# EAGLE design HalfMegCoCo (EAGLE 7.7.0)
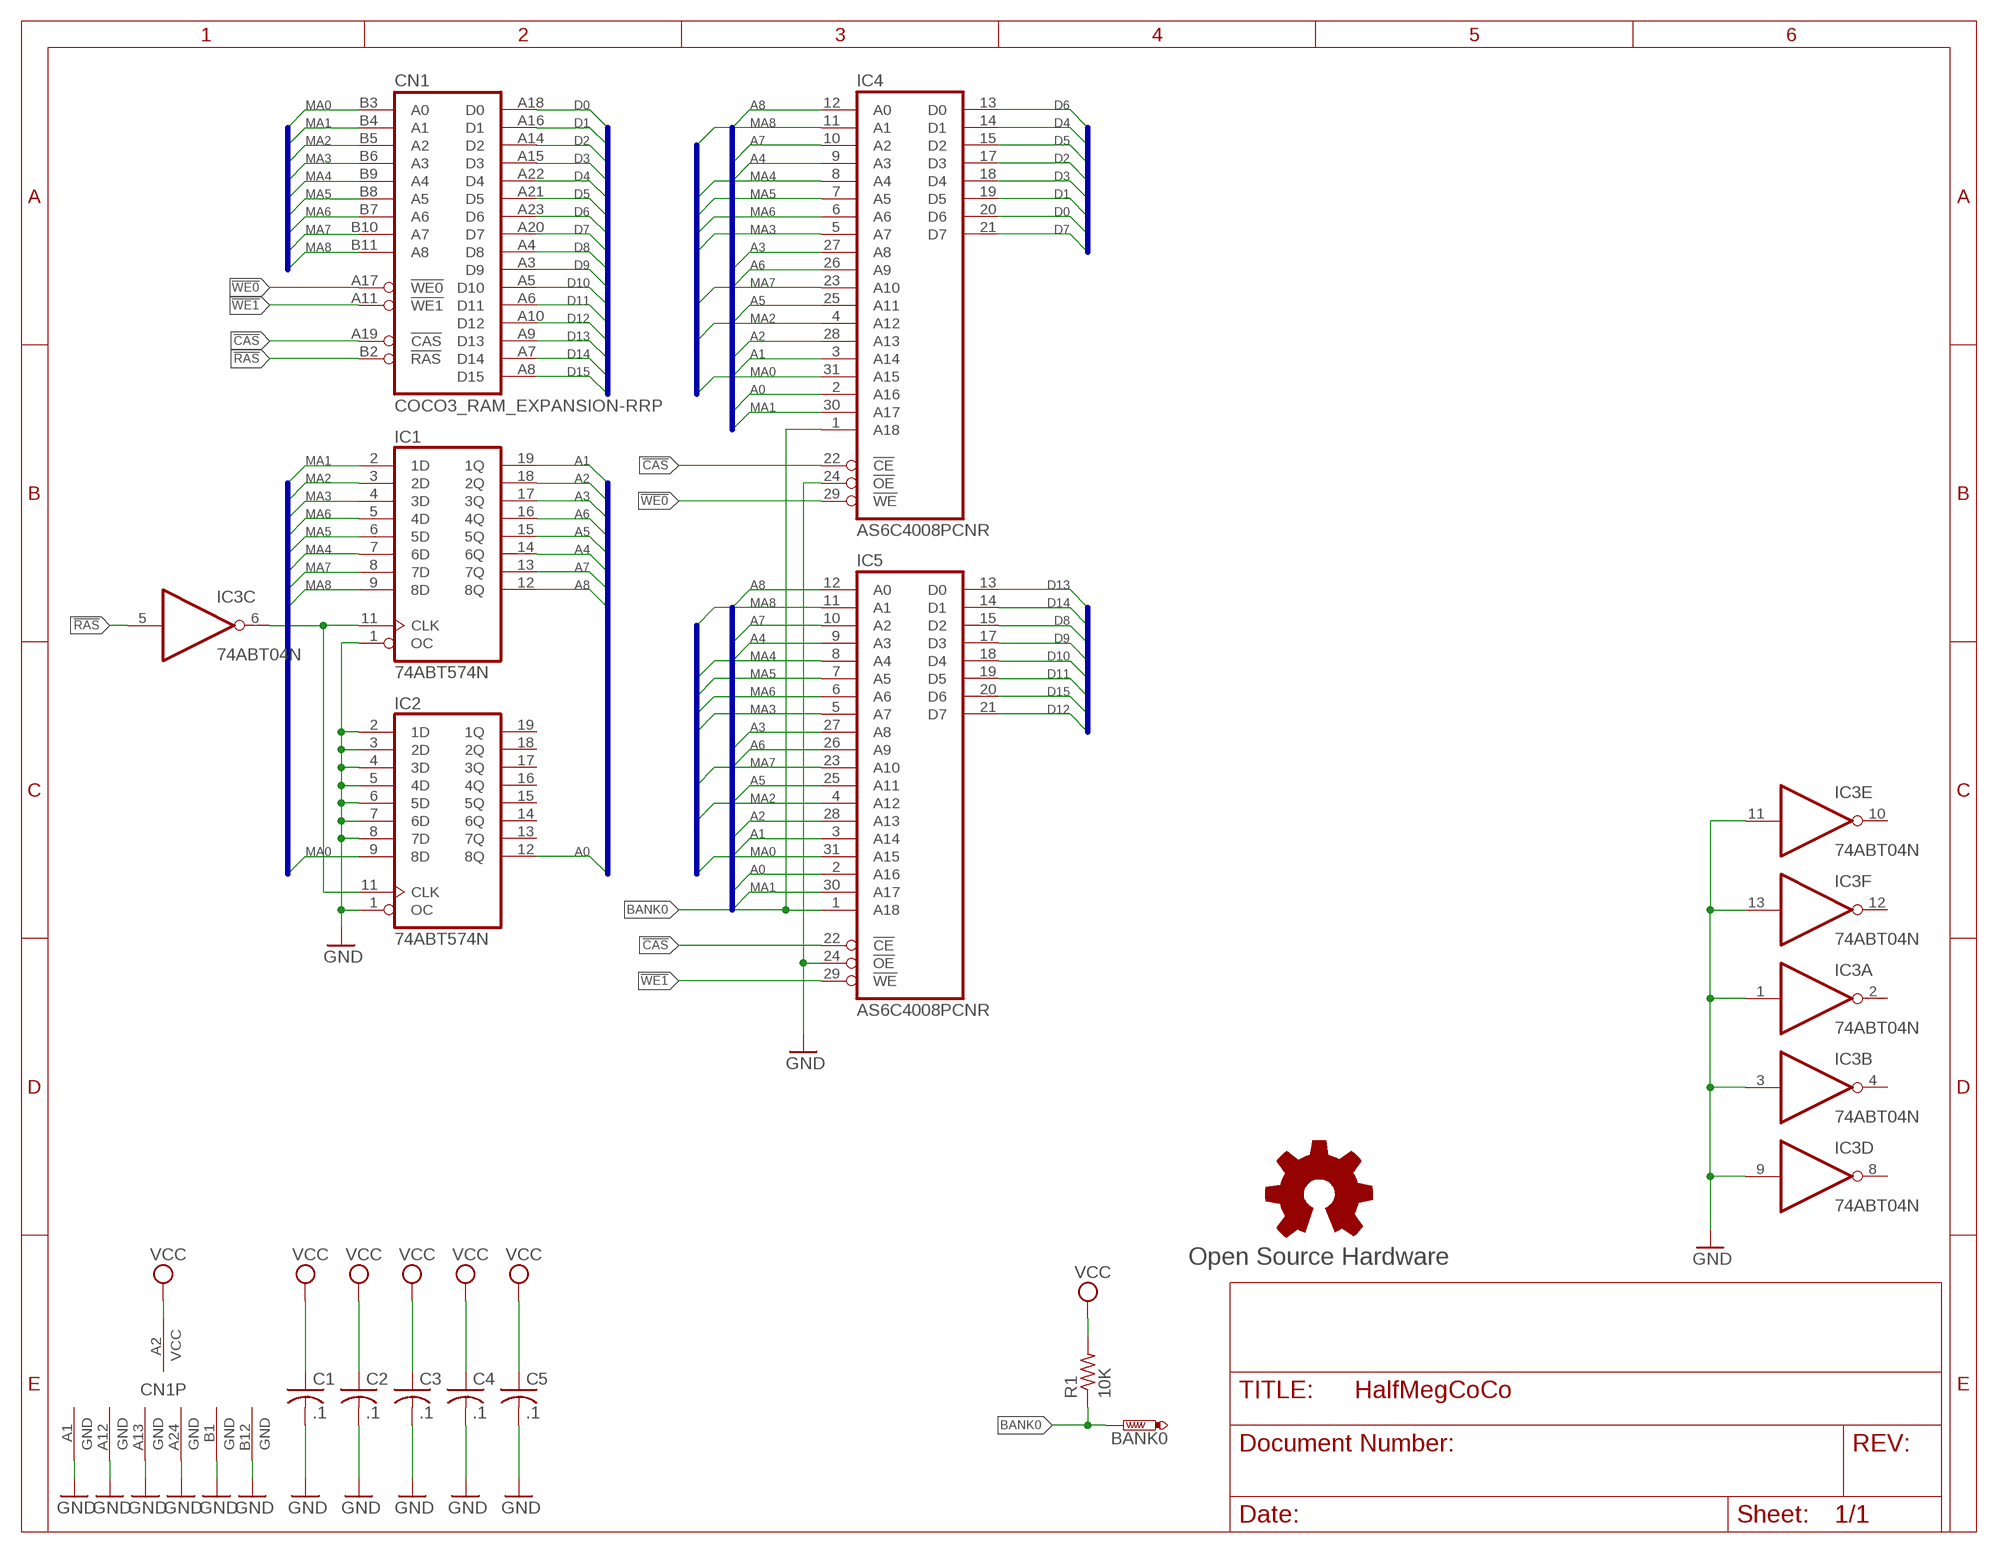
[diagram p0: schematic, sheet 1]

## Parts
BANK0  PTR1PAD1-13  [P1-13]
C1  .1  C-US025-025X050  [C025-025X050]
C2  .1  C-US025-025X050  [C025-025X050]
C3  .1  C-US025-025X050  [C025-025X050]
C4  .1  C-US025-025X050  [C025-025X050]
C5  .1  C-US025-025X050  [C025-025X050]
CN1  COCO3_RAM_EXPANSION-RRP  [RAM_EXPANSION_REV_RP]
GOLD_ORB_SM1  Open Source Hardware  OSHWLOGOLOGO8MM  [OSHW_8MM]
IC1  74ABT574N  74HC574N  [DIL20-RP]
IC2  74ABT574N  74HC574N  [DIL20-RP]
IC3  74ABT04N  74ALS04N  [DIL14-RP]
IC4  AS6C4008PCNR  [DIL32-RP]
IC5  AS6C4008PCNR  [DIL32-RP]
R1  10K  R-US_0204/7  [0204/7]

## Nets
!CAS: CN1.A19(!CAS) IC4.22(!CE) IC5.22(!CE)
!RAS: CN1.B2(!RAS) IC3.5(C:I)
!WE0: CN1.A17(!WE0) IC4.29(!WE)
!WE1: CN1.A11(!WE1) IC5.29(!WE)
A0: IC2.12(8Q) IC4.2(A16) IC5.2(A16)
A1: IC1.19(1Q) IC4.3(A14) IC5.3(A14)
A2: IC1.18(2Q) IC4.28(A13) IC5.28(A13)
A3: IC1.17(3Q) IC4.27(A8) IC5.27(A8)
A4: IC1.14(6Q) IC4.9(A3) IC5.9(A3)
A5: IC1.15(5Q) IC4.25(A11) IC5.25(A11)
A6: IC1.16(4Q) IC4.26(A9) IC5.26(A9)
A7: IC1.13(7Q) IC4.10(A2) IC5.10(A2)
A8: IC1.12(8Q) IC4.12(A0) IC5.12(A0)
BANK0: BANK0.TP IC4.1(A18) IC5.1(A18) R1.1
D0: CN1.A18(D0) IC4.20(D6)
D1: CN1.A16(D1) IC4.19(D5)
D2: CN1.A14(D2) IC4.17(D3)
D3: CN1.A15(D3) IC4.18(D4)
D4: CN1.A22(D4) IC4.14(D1)
D5: CN1.A21(D5) IC4.15(D2)
D6: CN1.A23(D6) IC4.13(D0)
D7: CN1.A20(D7) IC4.21(D7)
D8: CN1.A4(D8) IC5.15(D2)
D9: CN1.A3(D9) IC5.17(D3)
D10: CN1.A5(D10) IC5.18(D4)
D11: CN1.A6(D11) IC5.19(D5)
D12: CN1.A10(D12) IC5.21(D7)
D13: CN1.A9(D13) IC5.13(D0)
D14: CN1.A7(D14) IC5.14(D1)
D15: CN1.A8(D15) IC5.20(D6)
GND: C1.2 C2.2 C3.2 C4.2 C5.2 CN1.A1(GND) CN1.A12(GND) CN1.A13(GND) CN1.A24(GND) CN1.B1(GND) CN1.B12(GND) IC1.1(OC) IC2.1(OC) IC2.2(1D) IC2.3(2D) IC2.4(3D) IC2.5(4D) IC2.6(5D) IC2.7(6D) IC2.8(7D) IC3.1(A:I) IC3.3(B:I) IC3.9(D:I) IC3.11(E:I) IC3.13(F:I) IC4.24(!OE) IC5.24(!OE)
MA0: CN1.B3(A0) IC2.9(8D) IC4.31(A15) IC5.31(A15)
MA1: CN1.B4(A1) IC1.2(1D) IC4.30(A17) IC5.30(A17)
MA2: CN1.B5(A2) IC1.3(2D) IC4.4(A12) IC5.4(A12)
MA3: CN1.B6(A3) IC1.4(3D) IC4.5(A7) IC5.5(A7)
MA4: CN1.B9(A4) IC1.7(6D) IC4.8(A4) IC5.8(A4)
MA5: CN1.B8(A5) IC1.6(5D) IC4.7(A5) IC5.7(A5)
MA6: CN1.B7(A6) IC1.5(4D) IC4.6(A6) IC5.6(A6)
MA7: CN1.B10(A7) IC1.8(7D) IC4.23(A10) IC5.23(A10)
MA8: CN1.B11(A8) IC1.9(8D) IC4.11(A1) IC5.11(A1)
N$6: IC1.11(CLK) IC2.11(CLK) IC3.6(C:O)
VCC: C1.1 C2.1 C3.1 C4.1 C5.1 CN1.A2(VCC) R1.2
Unconnected: IC2.13(7Q) IC2.14(6Q) IC2.15(5Q) IC2.16(4Q) IC2.17(3Q) IC2.18(2Q) IC2.19(1Q) IC3.2(A:O) IC3.4(B:O) IC3.8(D:O) IC3.10(E:O) IC3.12(F:O)

## Buses
D[0..15]
MA[0..8]
A[0..8]

## Power pins joined to a net without a drawn wire
GND: IC1.10(GND) IC2.10(GND) IC3.7(P:GND) IC4.16(GND) IC5.16(GND)
VCC: IC1.20(VCC) IC2.20(VCC) IC3.14(P:VCC) IC4.32(VCC) IC5.32(VCC)

## Library data of the parts
BANK0 = testpad:PTR1: TEST PIN
C1-C5 = rcl:C-US: CAPACITOR, American symbol
CN1 = coco:COCO3_RAM_EXPANSION
GOLD_ORB_SM1 = oshw:OSHWLOGO: The OSHW logo for PCB layout
IC1 IC2 = 74xx-us-jlb:74*574: 8-bit D type FLIP FLOP bus driver
IC3 = 74xx-us-jlb:74*04: Hex INVERTER
IC4 IC5 = memory-alliance:AS6C4008
R1 = resistor:R-US_: RESISTOR, American symbol

## Board
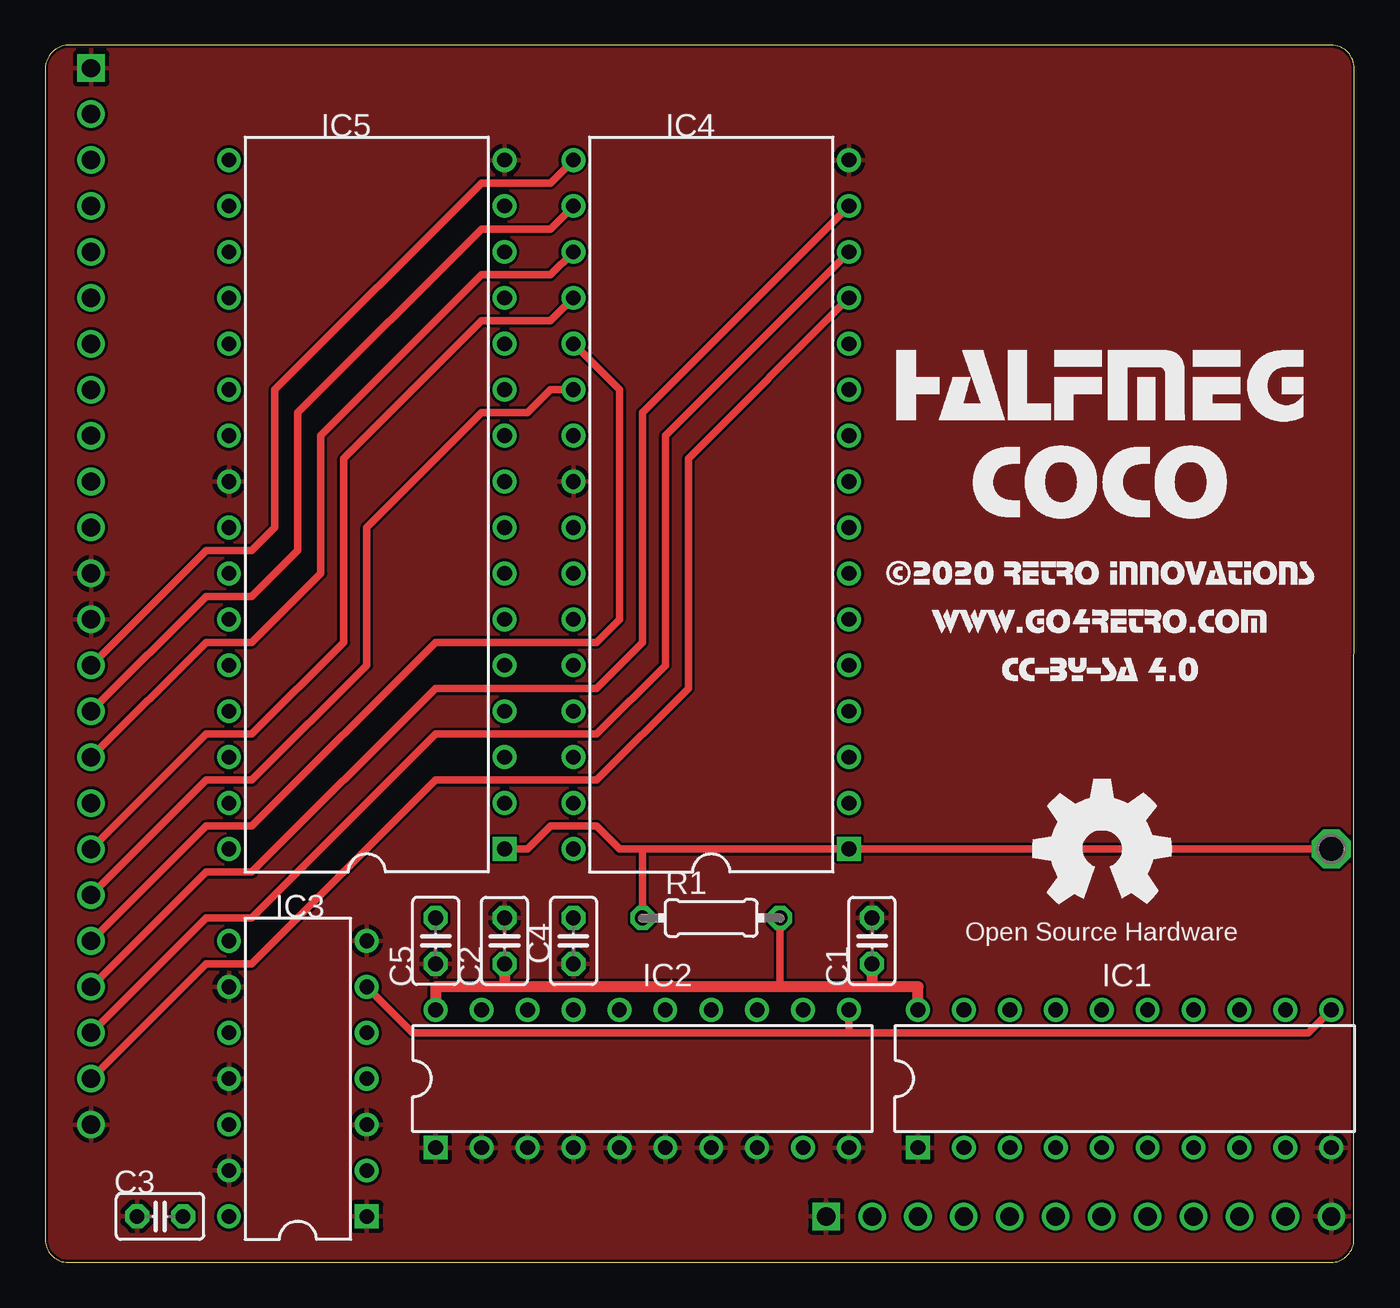
[diagram p1: board, top side]
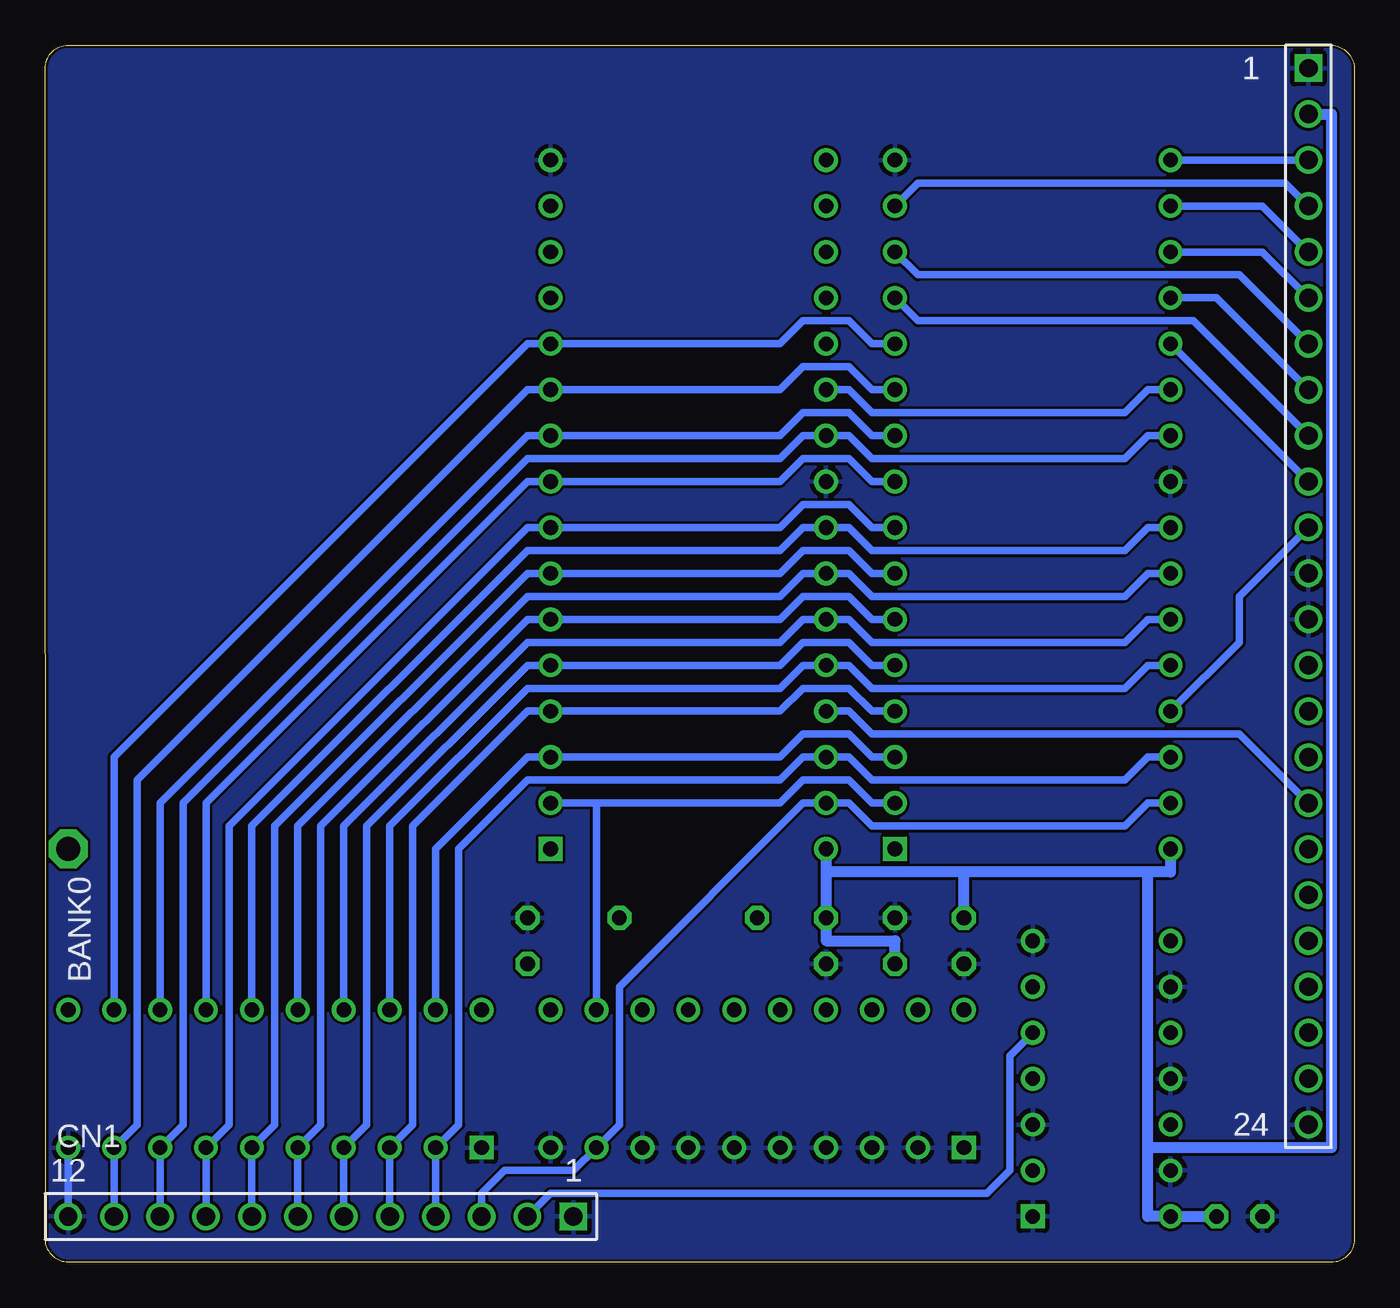
[diagram p2: board, bottom side, seen from below]

Size 72.39 x 67.31 mm. Coordinates in mm from the lower left corner, seen from the top.
Outline: 71.12,67.31 52.06,67.31 1.27,67.31 arc85 0,66.04 0,1.27 arc90 1.27,0 71.1,0 arc90 72.37,1.27 72.39,66.03 arc90 71.12,67.31
Copper layers (1*16): Top 0.035mm / dielectric 1.5mm / Bottom 0.035mm
Design rules "hackvana": minimum track width 6mil, minimum drill 0.3mm, track to track 6mil, track to pad 6mil, pad to pad 6mil, via to via 6mil, smd to smd 0mil, copper to edge 6mil, drill to drill 6mil, minimum pad ring 10mil, minimum via ring 6mil, stop-mask expansion 2mil, vias tented up to drill 100mil, thermal gap 10mil

### Footprints (pad centres in the part's own frame; a part is rotated, then mirrored left to right if it is on the bottom)
P1-13 = drill 1.321 pad 2.159 octagon: TP 0,0
C025-025X050 = drill 0.813 octagon: 1 -1.27,0; 2 1.27,0
RAM_EXPANSION_REV_RP = drill 1.016 square: A1 -34.29,31.75; B1 6.35,-31.75 | drill 1.016: A2 -34.29,29.21; A3 -34.29,26.67; A4 -34.29,24.13; A5 -34.29,21.59; A6 -34.29,19.05; A7 -34.29,16.51; A8 -34.29,13.97; A9 -34.29,11.43; A10 -34.29,8.89; A11 -34.29,6.35; A12 -34.29,3.81; A13 -34.29,1.27; A14 -34.29,-1.27; A15 -34.29,-3.81; A16 -34.29,-6.35; A17 -34.29,-8.89; A18 -34.29,-11.43; A19 -34.29,-13.97; A20 -34.29,-16.51; A21 -34.29,-19.05; A22 -34.29,-21.59; A23 -34.29,-24.13; A24 -34.29,-26.67; B2 8.89,-31.75; B3 11.43,-31.75; B4 13.97,-31.75; B5 16.51,-31.75; B6 19.05,-31.75; B7 21.59,-31.75; B8 24.13,-31.75; B9 26.67,-31.75; B10 29.21,-31.75; B11 31.75,-31.75; B12 34.29,-31.75
DIL20-RP = drill 0.813 square: 1 -11.43,-3.81 | drill 0.813: 2 -8.89,-3.81; 3 -6.35,-3.81; 4 -3.81,-3.81; 5 -1.27,-3.81; 6 1.27,-3.81; 7 3.81,-3.81; 8 6.35,-3.81; 9 8.89,-3.81; 10 11.43,-3.81; 11 11.43,3.81; 12 8.89,3.81; 13 6.35,3.81; 14 3.81,3.81; 15 1.27,3.81; 16 -1.27,3.81; 17 -3.81,3.81; 18 -6.35,3.81; 19 -8.89,3.81; 20 -11.43,3.81
DIL14-RP = drill 0.813 square: 1 -7.62,-3.81 | drill 0.813: 2 -5.08,-3.81; 3 -2.54,-3.81; 4 0,-3.81; 5 2.54,-3.81; 6 5.08,-3.81; 7 7.62,-3.81; 8 7.62,3.81; 9 5.08,3.81; 10 2.54,3.81; 11 0,3.81; 12 -2.54,3.81; 13 -5.08,3.81; 14 -7.62,3.81
DIL32-RP = drill 0.813 square: 1 -19.05,-7.62 | drill 0.813: 2 -16.51,-7.62; 3 -13.97,-7.62; 4 -11.43,-7.62; 5 -8.89,-7.62; 6 -6.35,-7.62; 7 -3.81,-7.62; 8 -1.27,-7.62; 9 1.27,-7.62; 10 3.81,-7.62; 11 6.35,-7.62; 12 8.89,-7.62; 13 11.43,-7.62; 14 13.97,-7.62; 15 16.51,-7.62; 16 19.05,-7.62; 17 19.05,7.62; 18 16.51,7.62; 19 13.97,7.62; 20 11.43,7.62; 21 8.89,7.62; 22 6.35,7.62; 23 3.81,7.62; 24 1.27,7.62; 25 -1.27,7.62; 26 -3.81,7.62; 27 -6.35,7.62; 28 -8.89,7.62; 29 -11.43,7.62; 30 -13.97,7.62; 31 -16.51,7.62; 32 -19.05,7.62
0204/7 = drill 0.813 octagon: 1 -3.81,0; 2 3.81,0

### Placement (x,y rotation side)
BANK0  71.12,22.86 0 top
C1  45.72,17.78 90 top
C2  25.4,17.78 90 top
C3  6.35,2.54 180 top
C4  29.21,17.78 270 top
C5  21.59,17.78 270 top
CN1  36.83,34.29 0 top
GOLD_ORB_SM1  58.42,22.86 0 top
IC1  59.69,10.16 0 top
IC2  33.02,10.16 0 top
IC3  13.97,10.16 90 top
IC4  36.83,41.91 90 top
IC5  17.78,41.91 90 top
R1  36.83,19.05 0 top

### Tracks (layer width: path | path; a pad name or v marks a point on that pad's centre or on a via)
!CAS
  Top 0.406: CN1.A19 8.89,26.67 11.43,26.67 17.78,33.02 17.78,40.64 24.13,46.99 26.67,46.99 27.94,48.26 IC4.22
  Bottom 0.406: IC4.22 27.94,48.26 26.67,46.99 12.7,46.99 11.43,48.26 IC5.22
!RAS
  Bottom 0.406: CN1.B2 44.45,3.81 20.32,3.81 19.05,5.08 19.05,11.43 IC3.5
!WE0
  Bottom 0.406: CN1.A17 6.35,29.21 26.67,29.21 27.94,30.48 IC4.29
!WE1
  Bottom 0.406: CN1.A11 6.35,36.83 6.35,34.29 IC5.29
A0
  Bottom 0.406: IC2.12 41.91,25.4 | 41.91,25.4 IC4.2 | IC5.2 26.67,25.4 27.94,26.67 30.48,26.67 31.75,25.4 41.91,25.4
A1
  Bottom 0.406: IC1.19 50.8,22.86 45.72,27.94 IC4.3 31.75,27.94 30.48,29.21 27.94,29.21 26.67,27.94 IC5.3
A2
  Bottom 0.406: IC1.18 53.34,24.13 45.72,31.75 31.75,31.75 30.48,33.02 IC4.28 27.94,33.02 26.67,31.75 12.7,31.75 11.43,33.02 IC5.28
A3
  Bottom 0.406: IC1.17 55.88,24.13 45.72,34.29 31.75,34.29 30.48,35.56 IC4.27 27.94,35.56 26.67,34.29 12.7,34.29 11.43,35.56 IC5.27
A4
  Bottom 0.406: IC1.14 63.5,25.4 45.72,43.18 IC4.9 31.75,43.18 30.48,44.45 27.94,44.45 26.67,43.18 IC5.9
A5
  Bottom 0.406: IC1.15 60.96,24.13 45.72,39.37 31.75,39.37 30.48,40.64 IC4.25 27.94,40.64 26.67,39.37 12.7,39.37 11.43,40.64 IC5.25
A6
  Bottom 0.406: IC1.16 58.42,24.13 45.72,36.83 31.75,36.83 30.48,38.1 IC4.26 27.94,38.1 26.67,36.83 12.7,36.83 11.43,38.1 IC5.26
A7
  Bottom 0.406: IC1.13 66.04,25.4 45.72,45.72 IC4.10 31.75,45.72 30.48,46.99 27.94,46.99 26.67,45.72 IC5.10
A8
  Bottom 0.406: IC1.12 68.58,27.94 45.72,50.8 IC4.12 31.75,50.8 30.48,52.07 27.94,52.07 26.67,50.8 IC5.12
BANK0
  Top 0.406: IC5.1 26.67,22.86 27.94,24.13 30.48,24.13 31.75,22.86 33.02,22.86 | 33.02,22.86 IC4.1 BANK0.TP | R1.1 33.02,22.86
D0
  Top 0.406: CN1.A18 8.89,29.21 11.43,29.21 16.51,34.29 16.51,44.45 24.13,52.07 27.94,52.07 IC4.20
D1
  Top 0.406: CN1.A16 8.89,34.29 11.43,34.29 15.24,38.1 15.24,45.72 24.13,54.61 27.94,54.61 IC4.19
D2
  Top 0.406: CN1.A14 8.89,39.37 11.43,39.37 12.7,40.64 12.7,48.26 24.13,59.69 27.94,59.69 IC4.17
D3
  Top 0.406: CN1.A15 8.89,36.83 11.43,36.83 13.97,39.37 13.97,46.99 24.13,57.15 27.94,57.15 IC4.18
D4
  Top 0.406: CN1.A22 8.89,19.05 11.43,19.05 21.59,29.21 30.48,29.21 34.29,33.02 34.29,45.72 IC4.14
D5
  Top 0.406: CN1.A21 8.89,21.59 11.43,21.59 21.59,31.75 30.48,31.75 33.02,34.29 33.02,46.99 IC4.15
D6
  Top 0.406: CN1.A23 8.89,16.51 11.43,16.51 21.59,26.67 30.48,26.67 35.56,31.75 35.56,44.45 IC4.13
D7
  Top 0.406: IC4.21 31.75,48.26 31.75,35.56 30.48,34.29 21.59,34.29 11.43,24.13 8.89,24.13 CN1.A20
D8
  Bottom 0.406: CN1.A4 3.81,59.69 24.13,59.69 IC5.15
D9
  Bottom 0.406: CN1.A3 IC5.17
D10
  Bottom 0.406: CN1.A5 5.08,58.42 IC5.18
D11
  Bottom 0.406: CN1.A6 5.08,55.88 IC5.19
D12
  Bottom 0.406: CN1.A10 IC5.21
D13
  Bottom 0.406: CN1.A9 8.89,52.07 24.13,52.07 IC5.13
D14
  Bottom 0.406: CN1.A7 6.35,54.61 24.13,54.61 IC5.14
D15
  Bottom 0.406: CN1.A8 7.62,53.34 IC5.20
GND
  Bottom 0.406: CN1.B12 IC1.10
  pour Bottom: 0,1.27 0,66.04 arc-90 1.27,67.31 71.12,67.31 arc-90 72.39,66.04 72.39,1.27 arc-90 71.12,0 1.27,0 arc-90
  pour Top: 0,1.27 0,66.04 arc-90 1.27,67.31 71.12,67.31 arc-90 72.39,66.04 72.39,1.27 arc-90 71.12,0 1.27,0 arc-90
MA0
  Bottom 0.406: CN1.B3 48.26,3.81 46.99,5.08 43.18,5.08 IC2.9 40.64,7.62 40.64,15.24 30.48,25.4 IC4.31 27.94,25.4 26.67,24.13 12.7,24.13 11.43,25.4 IC5.31
MA1
  Bottom 0.406: CN1.B4 IC1.2 49.53,7.62 49.53,22.86 45.72,26.67 31.75,26.67 30.48,27.94 IC4.30 27.94,27.94 26.67,26.67 12.7,26.67 11.43,27.94 IC5.30
MA2
  Bottom 0.406: CN1.B5 IC1.3 52.07,7.62 52.07,24.13 45.72,30.48 IC4.4 31.75,30.48 30.48,31.75 27.94,31.75 26.67,30.48 IC5.4
MA3
  Bottom 0.406: CN1.B6 IC1.4 54.61,7.62 54.61,24.13 45.72,33.02 IC4.5 31.75,33.02 30.48,34.29 27.94,34.29 26.67,33.02 IC5.5
MA4
  Bottom 0.406: CN1.B9 IC1.7 62.23,7.62 62.23,24.13 45.72,40.64 IC4.8 31.75,40.64 30.48,41.91 27.94,41.91 26.67,40.64 IC5.8
MA5
  Bottom 0.406: CN1.B8 IC1.6 59.69,7.62 59.69,24.13 45.72,38.1 IC4.7 31.75,38.1 30.48,39.37 27.94,39.37 26.67,38.1 IC5.7
MA6
  Bottom 0.406: CN1.B7 IC1.5 57.15,7.62 57.15,24.13 45.72,35.56 IC4.6 31.75,35.56 30.48,36.83 27.94,36.83 26.67,35.56 IC5.6
MA7
  Bottom 0.406: CN1.B10 IC1.8 64.77,7.62 64.77,25.4 45.72,44.45 31.75,44.45 30.48,45.72 IC4.23 27.94,45.72 26.67,44.45 12.7,44.45 11.43,45.72 IC5.23
MA8
  Bottom 0.406: CN1.B11 IC1.9 67.31,7.62 67.31,26.67 45.72,48.26 IC4.11 31.75,48.26 30.48,49.53 27.94,49.53 26.67,48.26 IC5.11
N$6
  Top 0.406: IC3.6 20.32,12.7 44.45,12.7 | 44.45,12.7 69.85,12.7 IC1.11 | IC2.11 44.45,12.7
VCC
  Top 0.406: R1.2 40.64,15.24
  Top 0.61: IC1.20 48.26,15.24 45.72,15.24 | 45.72,15.24 40.64,15.24 25.4,15.24 | 25.4,15.24 21.59,15.24 IC2.20 | C2.1 25.4,15.24 | C1.1 45.72,15.24
  Bottom 0.61: IC4.32 29.21,21.59 | IC5.32 10.16,21.59 11.43,21.59 | 11.43,21.59 21.59,21.59 | 21.59,21.59 29.21,21.59 | 29.21,21.59 C4.1 29.21,17.78 25.4,17.78 C2.1 | C5.1 21.59,21.59 | C3.1 IC3.14 11.43,2.54 11.43,6.35 | 11.43,6.35 11.43,21.59 | CN1.A2 1.27,63.5 1.27,6.35 11.43,6.35